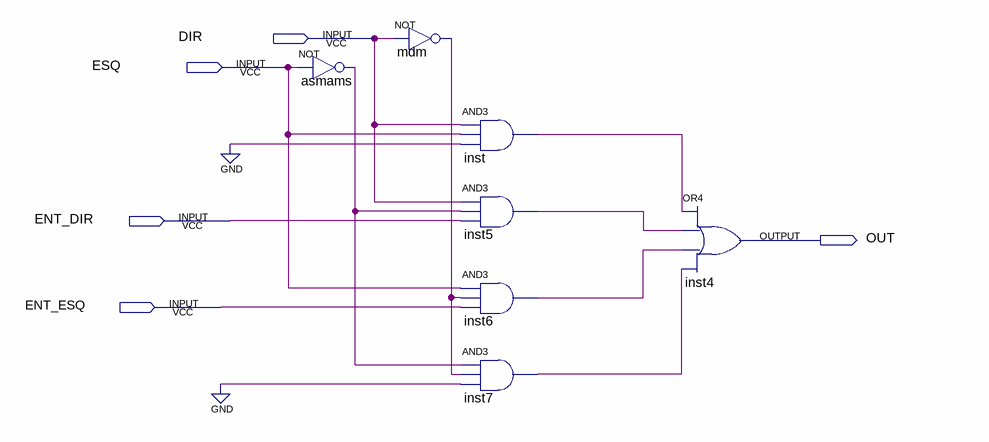
[diagram p0: schematic sheet]
// Quartus schematic mux4-1.bdf as structural Verilog: 7 symbols, 5 pins
module \mux4-1  (
  input  DIR,
  input  ESQ,
  input  ENT_DIR,
  input  ENT_ESQ,
  output OUT
);

  wire asmams_out, inst5_out, inst6_out, inst7_out, inst_out, mdm_out;

  not asmams (asmams_out, ESQ);
  not mdm (mdm_out, DIR);
  and inst (inst_out, DIR, ESQ, 1'b0);
  and inst5 (inst5_out, DIR, asmams_out, ENT_DIR);
  and inst6 (inst6_out, ESQ, mdm_out, ENT_ESQ);
  and inst7 (inst7_out, asmams_out, mdm_out, 1'b0);
  or inst4 (OUT, inst_out, inst5_out, inst6_out, inst7_out);
endmodule
